# Altium schematic sheet Mako DSP Memory R2.0 - Copy.SchDoc
size A
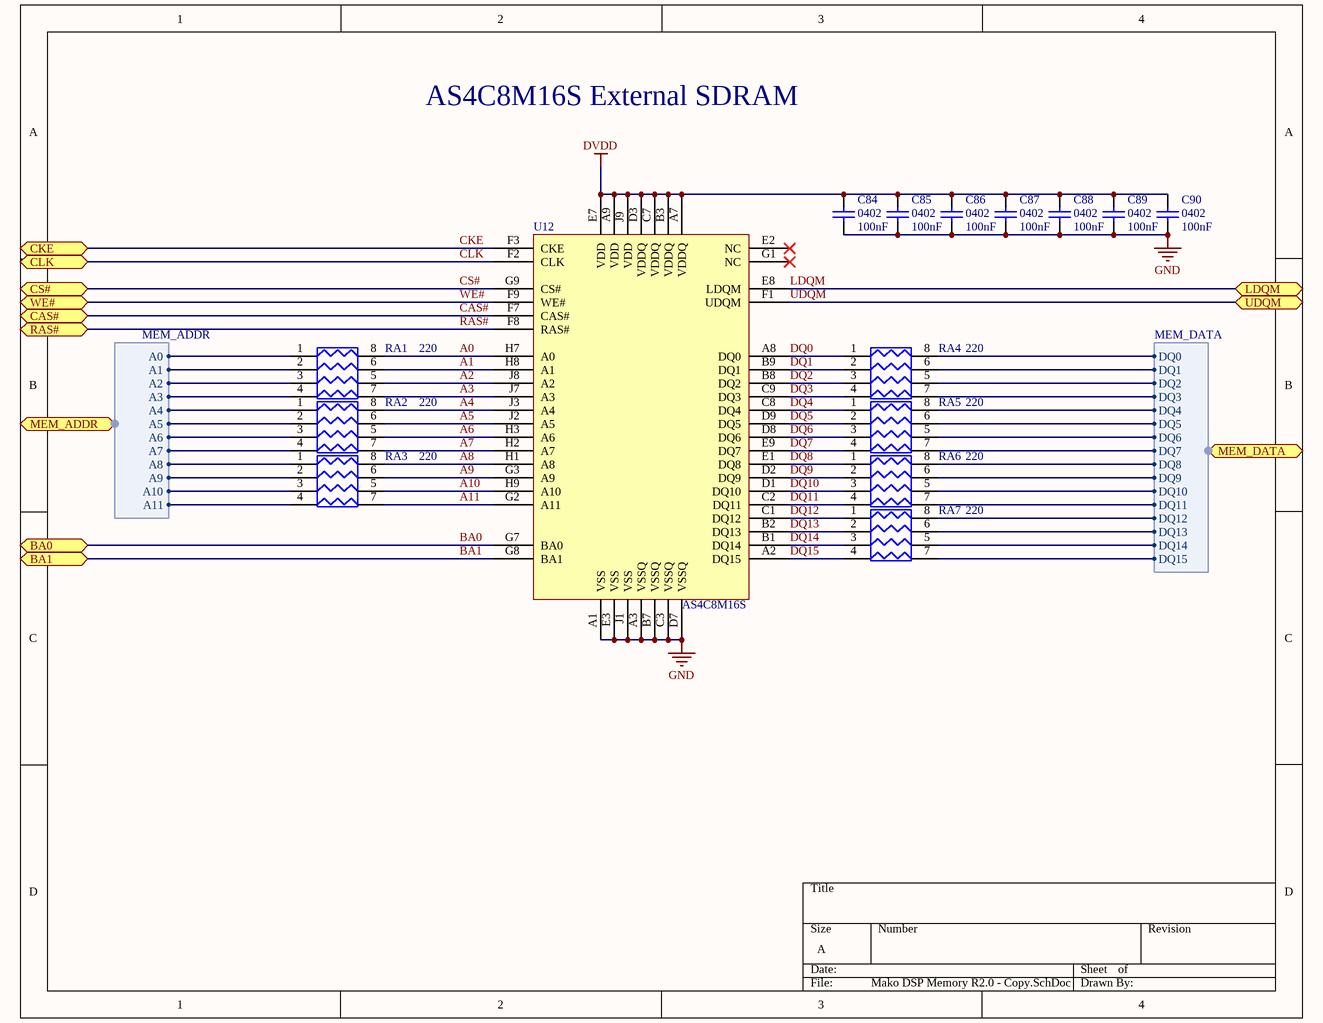
[diagram p0: Mako DSP Memory R2.0 - Copy.SchDoc]

## Parts
C84  0402  value 100nF  [0402]
C85  0402  value 100nF  [0402]
C86  0402  value 100nF  [0402]
C87  0402  value 100nF  [0402]
C88  0402  value 100nF  [0402]
C89  0402  value 100nF  [0402]
C90  0402  value 100nF  [0402]
RA1  value 220  [742C083]  (hidden comment: RESISTOR ARRAY)
RA2  value 220  [742C083]  (hidden comment: RESISTOR ARRAY)
RA3  value 220  [742C083]  (hidden comment: RESISTOR ARRAY)
RA4  value 220  [742C083]  (hidden comment: RESISTOR ARRAY)
RA5  value 220  [742C083]  (hidden comment: RESISTOR ARRAY)
RA6  value 220  [742C083]  (hidden comment: RESISTOR ARRAY)
RA7  value 220  [742C083]  (hidden comment: RESISTOR ARRAY)
U12  AS4C8M16S  [AS4C8M16S]

## Ports
BA0, BA1, CAS#, CKE, CLK, CS#, LDQM, MEM_ADDR (harness MEM_ADDR), MEM_DATA (harness MEM_DATA), RAS#, UDQM, WE#

## Harnesses
MEM_ADDR: A0, A1, A2, A3, A4, A5, A6, A7, A8, A9, A10, A11
MEM_DATA: DQ0, DQ1, DQ2, DQ3, DQ4, DQ5, DQ6, DQ7, DQ8, DQ9, DQ10, DQ11, DQ12, DQ13, DQ14, DQ15

## Nets
DVDD: C84.2 C85.2 C86.2 C87.2 C88.2 C89.2 C90.2 U12.A7(VDDQ) U12.A9(VDD) U12.B3(VDDQ) U12.C7(VDDQ) U12.D3(VDDQ) U12.E7(VDD) U12.J9(VDD)
GND: C84.1 C85.1 C86.1 C87.1 C88.1 C89.1 C90.1 U12.A1(VSS) U12.A3(VSSQ) U12.B7(VSSQ) U12.C3(VSSQ) U12.D7(VSSQ) U12.E3(VSS) U12.J1(VSS)
A0: RA1.8 U12.H7(A0)
A1: RA1.6 U12.H8(A1)
A2: RA1.5 U12.J8(A2)
A3: RA1.7 U12.J7(A3)
A4: RA2.8 U12.J3(A4)
A5: RA2.6 U12.J2(A5)
A6: RA2.5 U12.H3(A6)
A7: RA2.7 U12.H2(A7)
A8: RA3.8 U12.H1(A8)
A9: RA3.6 U12.G3(A9)
A10: RA3.5 U12.H9(A10)
A11: RA3.7 U12.G2(A11)
BA0: U12.G7(BA0) ; port BA0
BA1: U12.G8(BA1) ; port BA1
CAS#: U12.F7(CAS#) ; port CAS#
CKE: U12.F3(CKE) ; port CKE
CLK: U12.F2(CLK) ; port CLK
CS#: U12.G9(CS#) ; port CS#
DQ0: RA4.1 U12.A8(DQ0)
DQ1: RA4.2 U12.B9(DQ1)
DQ2: RA4.3 U12.B8(DQ2)
DQ3: RA4.4 U12.C9(DQ3)
DQ4: RA5.1 U12.C8(DQ4)
DQ5: RA5.2 U12.D9(DQ5)
DQ6: RA5.3 U12.D8(DQ6)
DQ7: RA5.4 U12.E9(DQ7)
DQ8: RA6.1 U12.E1(DQ8)
DQ9: RA6.2 U12.D2(DQ9)
DQ10: RA6.3 U12.D1(DQ10)
DQ11: RA6.4 U12.C2(DQ11)
DQ12: RA7.1 U12.C1(DQ12)
DQ13: RA7.2 U12.B2(DQ13)
DQ14: RA7.3 U12.B1(DQ14)
DQ15: RA7.4 U12.A2(DQ15)
LDQM: U12.E8(LDQM) ; port LDQM
RAS#: U12.F8(RAS#) ; port RAS#
UDQM: U12.F1(UDQM) ; port UDQM
WE#: U12.F9(WE#) ; port WE#
NetRA1_1: RA1.1 ; port MEM_ADDR.A0
NetRA1_2: RA1.2 ; port MEM_ADDR.A1
NetRA1_3: RA1.3 ; port MEM_ADDR.A2
NetRA1_4: RA1.4 ; port MEM_ADDR.A3
NetRA2_1: RA2.1 ; port MEM_ADDR.A4
NetRA2_2: RA2.2 ; port MEM_ADDR.A5
NetRA2_3: RA2.3 ; port MEM_ADDR.A6
NetRA2_4: RA2.4 ; port MEM_ADDR.A7
NetRA3_1: RA3.1 ; port MEM_ADDR.A8
NetRA3_2: RA3.2 ; port MEM_ADDR.A9
NetRA3_3: RA3.3 ; port MEM_ADDR.A10
NetRA3_4: RA3.4 ; port MEM_ADDR.A11
NetRA4_5: RA4.5 ; port MEM_DATA.DQ2
NetRA4_6: RA4.6 ; port MEM_DATA.DQ1
NetRA4_7: RA4.7 ; port MEM_DATA.DQ3
NetRA4_8: RA4.8 ; port MEM_DATA.DQ0
NetRA5_5: RA5.5 ; port MEM_DATA.DQ6
NetRA5_6: RA5.6 ; port MEM_DATA.DQ5
NetRA5_7: RA5.7 ; port MEM_DATA.DQ7
NetRA5_8: RA5.8 ; port MEM_DATA.DQ4
NetRA6_5: RA6.5 ; port MEM_DATA.DQ10
NetRA6_6: RA6.6 ; port MEM_DATA.DQ9
NetRA6_7: RA6.7 ; port MEM_DATA.DQ11
NetRA6_8: RA6.8 ; port MEM_DATA.DQ8
NetRA7_5: RA7.5 ; port MEM_DATA.DQ14
NetRA7_6: RA7.6 ; port MEM_DATA.DQ13
NetRA7_7: RA7.7 ; port MEM_DATA.DQ15
NetRA7_8: RA7.8 ; port MEM_DATA.DQ12

Not connected (* = marked no-connect by the designer): U12 E2(NC)* G1(NC)*

## Notes on the sheet
- AS4C8M16S External SDRAM

## Library data of the parts
C84-C90 = Cap Semi: Capacitor (Semiconductor SIM Model); Published: 8-Jun-2000; LatestRevisionDate: 29-May-2009; LatestRevisionNote: IPC-7351 Footprint Added.; PackageReference: C1206; Publisher: Altium Limited; PackageDescription: Chip Capacitor